# Altium schematic sheet 1-stm32.SchDoc
size A3 portrait
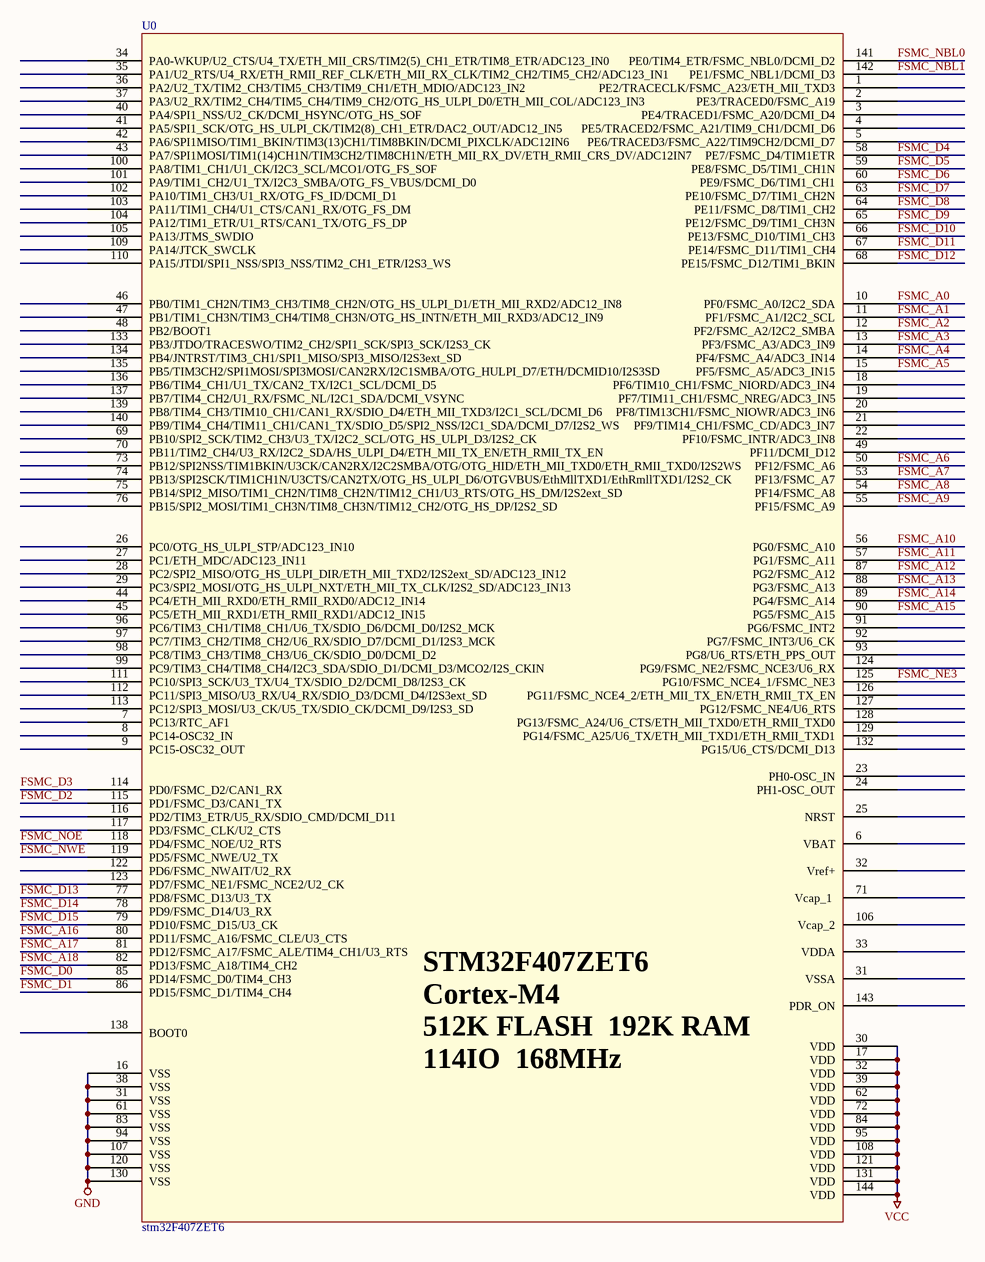
[diagram p0: 1-stm32.SchDoc]

## Parts
U0  stm32F407ZET6  [STM-LQFP144_M]

## Nets
GND: U0.16(VSS) U0.31(VSS) U0.38(VSS) U0.61(VSS) U0.83(VSS) U0.94(VSS) U0.107(VSS) U0.120(VSS) U0.130(VSS)
VCC: U0.17(VDD) U0.30(VDD) U0.32(VDD) U0.39(VDD) U0.62(VDD) U0.72(VDD) U0.84(VDD) U0.95(VDD) U0.108(VDD) U0.121(VDD) U0.131(VDD) U0.144(VDD)
FSMC_A0: U0.10(PF0/FSMC_A0/I2C2_SDA)
FSMC_A1: U0.11(PF1/FSMC_A1/I2C2_SCL)
FSMC_A2: U0.12(PF2/FSMC_A2/I2C2_SMBA)
FSMC_A3: U0.13(PF3/FSMC_A3/ADC3_IN9)
FSMC_A4: U0.14(PF4/FSMC_A4/ADC3_IN14)
FSMC_A5: U0.15(PF5/FSMC_A5/ADC3_IN15)
FSMC_A6: U0.50(PF12/FSMC_A6)
FSMC_A7: U0.53(PF13/FSMC_A7)
FSMC_A8: U0.54(PF14/FSMC_A8)
FSMC_A9: U0.55(PF15/FSMC_A9)
FSMC_A10: U0.56(PG0/FSMC_A10)
FSMC_A11: U0.57(PG1/FSMC_A11)
FSMC_A12: U0.87(PG2/FSMC_A12)
FSMC_A13: U0.88(PG3/FSMC_A13)
FSMC_A14: U0.89(PG4/FSMC_A14)
FSMC_A15: U0.90(PG5/FSMC_A15)
FSMC_A16: U0.80(PD11/FSMC_A16/FSMC_CLE/U3_CTS)
FSMC_A17: U0.81(PD12/FSMC_A17/FSMC_ALE/TIM4_CH1/U3_RTS)
FSMC_A18: U0.82(PD13/FSMC_A18/TIM4_CH2)
FSMC_D0: U0.85(PD14/FSMC_D0/TIM4_CH3)
FSMC_D1: U0.86(PD15/FSMC_D1/TIM4_CH4)
FSMC_D2: U0.115(PD1/FSMC_D3/CAN1_TX)
FSMC_D3: U0.114(PD0/FSMC_D2/CAN1_RX)
FSMC_D4: U0.58(PE7/FSMC_D4/TIM1ETR)
FSMC_D5: U0.59(PE8/FSMC_D5/TIM1_CH1N)
FSMC_D6: U0.60(PE9/FSMC_D6/TIM1_CH1)
FSMC_D7: U0.63(PE10/FSMC_D7/TIM1_CH2N)
FSMC_D8: U0.64(PE11/FSMC_D8/TIM1_CH2)
FSMC_D9: U0.65(PE12/FSMC_D9/TIM1_CH3N)
FSMC_D10: U0.66(PE13/FSMC_D10/TIM1_CH3)
FSMC_D11: U0.67(PE14/FSMC_D11/TIM1_CH4)
FSMC_D12: U0.68(PE15/FSMC_D12/TIM1_BKIN)
FSMC_D13: U0.77(PD8/FSMC_D13/U3_TX)
FSMC_D14: U0.78(PD9/FSMC_D14/U3_RX)
FSMC_D15: U0.79(PD10/FSMC_D15/U3_CK)
FSMC_NBL0: U0.141(PE0/TIM4_ETR/FSMC_NBL0/DCMI_D2)
FSMC_NBL1: U0.142(PE1/FSMC_NBL1/DCMI_D3)
FSMC_NE3: U0.125(PG10/FSMC_NCE4_1/FSMC_NE3)
FSMC_NOE: U0.118(PD4/FSMC_NOE/U2_RTS)
FSMC_NWE: U0.119(PD5/FSMC_NWE/U2_TX)

Not connected (* = marked no-connect by the designer): U0 1(PE2/TRACECLK/FSMC_A23/ETH_MII_TXD3) 2(PE3/TRACED0/FSMC_A19) 3(PE4/TRACED1/FSMC_A20/DCMI_D4) 4(PE5/TRACED2/FSMC_A21/TIM9_CH1/DCMI_D6) 5(PE6/TRACED3/FSMC_A22/TIM9CH2/DCMI_D7) 6(VBAT) 7(PC13/RTC_AF1) 8(PC14-OSC32_IN) 9(PC15-OSC32_OUT) 18(PF6/TIM10_CH1/FSMC_NIORD/ADC3_IN4) 19(PF7/TIM11_CH1/FSMC_NREG/ADC3_IN5) 20(PF8/TIM13CH1/FSMC_NIOWR/ADC3_IN6) 21(PF9/TIM14_CH1/FSMC_CD/ADC3_IN7) 22(PF10/FSMC_INTR/ADC3_IN8) 23(PH0-OSC_IN) 24(PH1-OSC_OUT) 25(NRST) 26(PC0/OTG_HS_ULPI_STP/ADC123_IN10) 27(PC1/ETH_MDC/ADC123_IN11) 28(PC2/SPI2_MISO/OTG_HS_ULPI_DIR/ETH_MII_TXD2/I2S2ext_SD/ADC123_IN12) 29(PC3/SPI2_MOSI/OTG_HS_ULPI_NXT/ETH_MII_TX_CLK/I2S2_SD/ADC123_IN13) 33(VDDA) 34(PA0-WKUP/U2_CTS/U4_TX/ETH_MII_CRS/TIM2(5)_CH1_ETR/TIM8_ETR/ADC123_IN0) 35(PA1/U2_RTS/U4_RX/ETH_RMII_REF_CLK/ETH_MII_RX_CLK/TIM2_CH2/TIM5_CH2/ADC123_IN1) 36(PA2/U2_TX/TIM2_CH3/TIM5_CH3/TIM9_CH1/ETH_MDIO/ADC123_IN2) 37(PA3/U2_RX/TIM2_CH4/TIM5_CH4/TIM9_CH2/OTG_HS_ULPI_D0/ETH_MII_COL/ADC123_IN3) 40(PA4/SPI1_NSS/U2_CK/DCMI_HSYNC/OTG_HS_SOF) 41(PA5/SPI1_SCK/OTG_HS_ULPI_CK/TIM2(8)_CH1_ETR/DAC2_OUT/ADC12_IN5) 42(PA6/SPI1MISO/TIM1_BKIN/TIM3(13)CH1/TIM8BKIN/DCMI_PIXCLK/ADC12IN6) 43(PA7/SPI1MOSI/TIM1(14)CH1N/TIM3CH2/TIM8CH1N/ETH_MII_RX_DV/ETH_RMII_CRS_DV/ADC12IN7) 44(PC4/ETH_MII_RXD0/ETH_RMII_RXD0/ADC12_IN14) 45(PC5/ETH_MII_RXD1/ETH_RMII_RXD1/ADC12_IN15) 46(PB0/TIM1_CH2N/TIM3_CH3/TIM8_CH2N/OTG_HS_ULPI_D1/ETH_MII_RXD2/ADC12_IN8) 47(PB1/TIM1_CH3N/TIM3_CH4/TIM8_CH3N/OTG_HS_INTN/ETH_MII_RXD3/ADC12_IN9) 48(PB2/BOOT1) 49(PF11/DCMI_D12) 69(PB10/SPI2_SCK/TIM2_CH3/U3_TX/I2C2_SCL/OTG_HS_ULPI_D3/I2S2_CK) 70(PB11/TIM2_CH4/U3_RX/I2C2_SDA/HS_ULPI_D4/ETH_MII_TX_EN/ETH_RMII_TX_EN) 71(Vcap_1_) 73(PB12/SPI2NSS/TIM1BKIN/U3CK/CAN2RX/I2C2SMBA/OTG/OTG_HID/ETH_MII_TXD0/ETH_RMII_TXD0/I2S2WS) 74(PB13/SPI2SCK/TIM1CH1N/U3CTS/CAN2TX/OTG_HS_ULPI_D6/OTGVBUS/EthMllTXD1/EthRmllTXD1/I2S2_CK) 75(PB14/SPI2_MISO/TIM1_CH2N/TIM8_CH2N/TIM12_CH1/U3_RTS/OTG_HS_DM/I2S2ext_SD) 76(PB15/SPI2_MOSI/TIM1_CH3N/TIM8_CH3N/TIM12_CH2/OTG_HS_DP/I2S2_SD) 91(PG6/FSMC_INT2) 92(PG7/FSMC_INT3/U6_CK) 93(PG8/U6_RTS/ETH_PPS_OUT) 96(PC6/TIM3_CH1/TIM8_CH1/U6_TX/SDIO_D6/DCMI_D0/I2S2_MCK) 97(PC7/TIM3_CH2/TIM8_CH2/U6_RX/SDIO_D7/DCMI_D1/I2S3_MCK) 98(PC8/TIM3_CH3/TIM8_CH3/U6_CK/SDIO_D0/DCMI_D2) 99(PC9/TIM3_CH4/TIM8_CH4/I2C3_SDA/SDIO_D1/DCMI_D3/MCO2/I2S_CKIN) 100(PA8/TIM1_CH1/U1_CK/I2C3_SCL/MCO1/OTG_FS_SOF) 101(PA9/TIM1_CH2/U1_TX/I2C3_SMBA/OTG_FS_VBUS/DCMI_D0) 102(PA10/TIM1_CH3/U1_RX/OTG_FS_ID/DCMI_D1) 103(PA11/TIM1_CH4/U1_CTS/CAN1_RX/OTG_FS_DM) 104(PA12/TIM1_ETR/U1_RTS/CAN1_TX/OTG_FS_DP) 105(PA13/JTMS_SWDIO) 106(Vcap_2) 109(PA14/JTCK_SWCLK) 110(PA15/JTDI/SPI1_NSS/SPI3_NSS/TIM2_CH1_ETR/I2S3_WS) 111(PC10/SPI3_SCK/U3_TX/U4_TX/SDIO_D2/DCMI_D8/I2S3_CK) 112(PC11/SPI3_MISO/U3_RX/U4_RX/SDIO_D3/DCMI_D4/I2S3ext_SD) 113(PC12/SPI3_MOSI/U3_CK/U5_TX/SDIO_CK/DCMI_D9/I2S3_SD) 116(PD2/TIM3_ETR/U5_RX/SDIO_CMD/DCMI_D11) 117(PD3/FSMC_CLK/U2_CTS) 122(PD6/FSMC_NWAIT/U2_RX) 123(PD7/FSMC_NE1/FSMC_NCE2/U2_CK) 124(PG9/FSMC_NE2/FSMC_NCE3/U6_RX) 126(PG11/FSMC_NCE4_2/ETH_MII_TX_EN/ETH_RMII_TX_EN) 127(PG12/FSMC_NE4/U6_RTS) 128(PG13/FSMC_A24/U6_CTS/ETH_MII_TXD0/ETH_RMII_TXD0) 129(PG14/FSMC_A25/U6_TX/ETH_MII_TXD1/ETH_RMII_TXD1) 132(PG15/U6_CTS/DCMI_D13) 133(PB3/JTDO/TRACESWO/TIM2_CH2/SPI1_SCK/SPI3_SCK/I2S3_CK) 134(PB4/JNTRST/TIM3_CH1/SPI1_MISO/SPI3_MISO/I2S3ext_SD) 135(PB5/TIM3CH2/SPI1MOSI/SPI3MOSI/CAN2RX/I2C1SMBA/OTG_HULPI_D7/ETH/DCMID10/I2S3SD) 136(PB6/TIM4_CH1/U1_TX/CAN2_TX/I2C1_SCL/DCMI_D5) 137(PB7/TIM4_CH2/U1_RX/FSMC_NL/I2C1_SDA/DCMI_VSYNC) 138(BOOT0) 139(PB8/TIM4_CH3/TIM10_CH1/CAN1_RX/SDIO_D4/ETH_MII_TXD3/I2C1_SCL/DCMI_D6) 140(PB9/TIM4_CH4/TIM11_CH1/CAN1_TX/SDIO_D5/SPI2_NSS/I2C1_SDA/DCMI_D7/I2S2_WS) 143(PDR_ON)

## Notes on the sheet
- (in symbol stm32F407ZET6) STM32F407ZET6 / Cortex-M4 / 512K FLASH  192K RAM / 114IO  168MHz /